# Altium project VG扩展板.PrjPCB
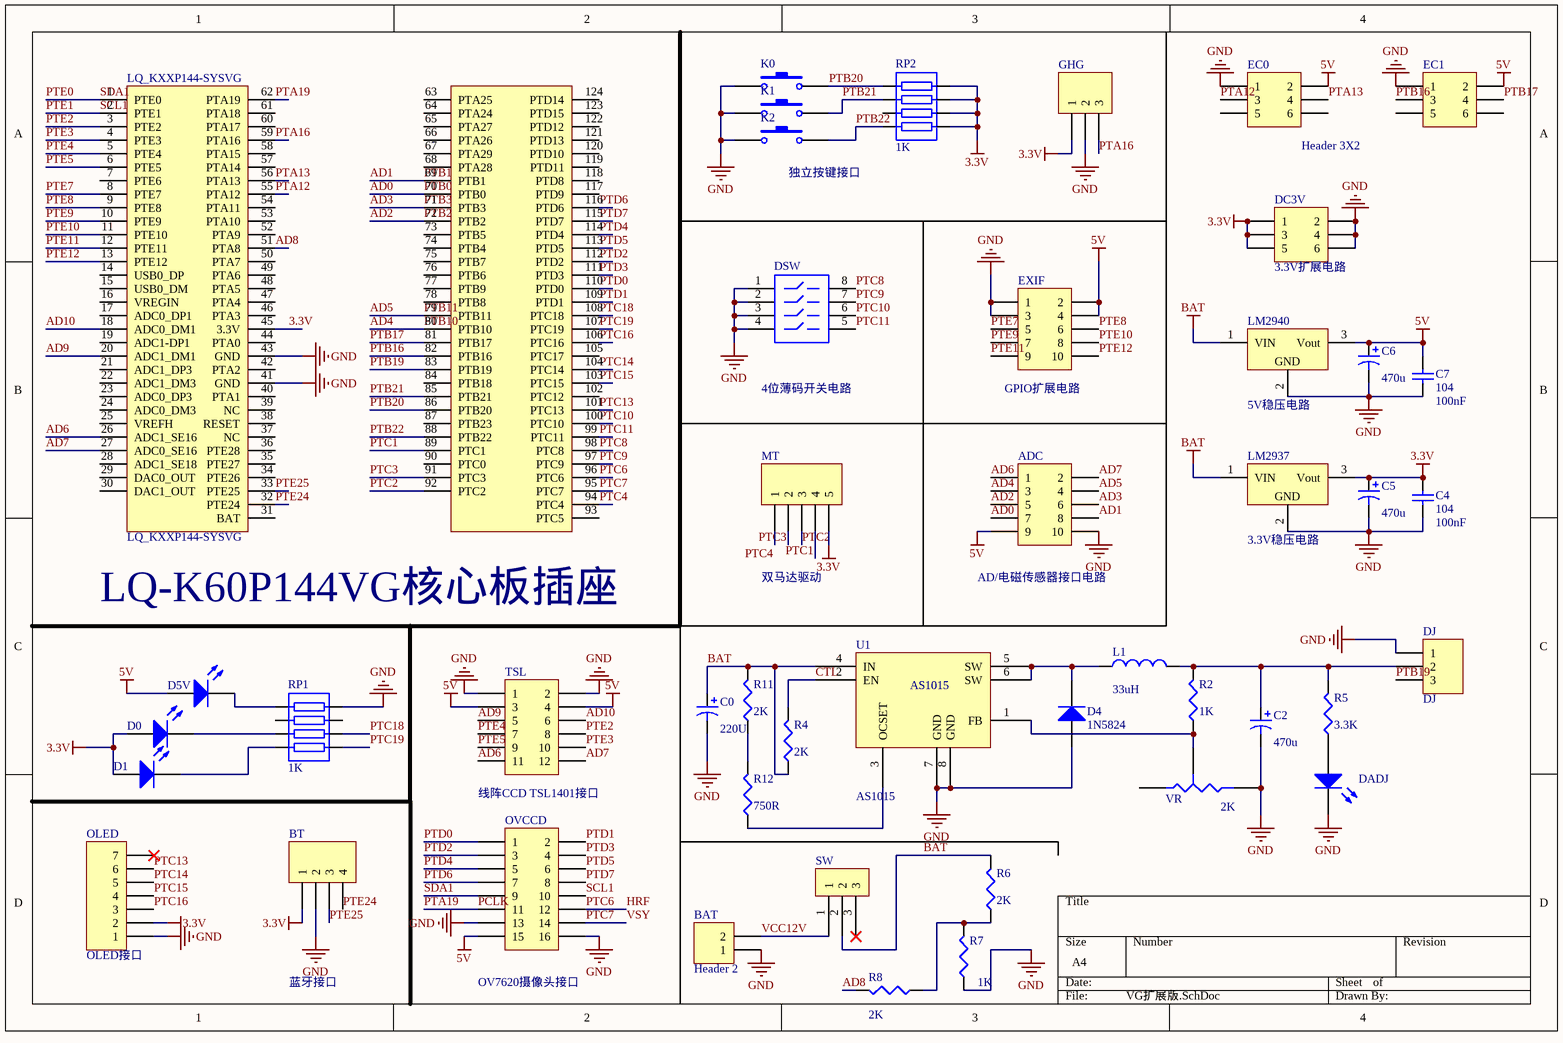
[diagram p0: VG扩展版.SchDoc]
1 sheet, 45 parts. Net scope: global (net labels, ports and power ports of the same name join across sheets).
Board file: VG扩展板.PcbDoc

## Sheet VG扩展版.SchDoc
size A4

### Parts
ADC  AD/电磁传感器接口电路  [HDR2X5]
BAT  Header 2  [power1]
BT  蓝牙接口  [HDR1X4]
C0  value 220U  [rb -5]
C2  value 470u  [3527]
C4  104  value 100nF  [0603]
C5  value 470u  [3527]
C6  value 470u  [3527]
C7  104  value 100nF  [0603]
D0  (no value)  [3.2X1.6X1.1]
D1  (no value)  [3.2X1.6X1.1]
D4  1N5824  [1812_DIODE]
D5V  (no value)  [3.2X1.6X1.1]
DADJ  (no value)  [3.2X1.6X1.1]
DC3V  3.3V扩展电路  [HDR2X3]
DJ  DJ  [HDR1X3]
DSW  4位薄码开关电路  [DIP-8]
EC0  (no value)  [HDR2X3]
EC1  Header 3X2  [HDR2X3]
EXIF  GPIO扩展电路  [HDR2X5]
GHG  (no value)  [HDR1X3]
K0  (no value)  [2512R]
K1  (no value)  [2512R]
K2  (no value)  [2512R]
L1  value 33uH  [CL1010]
LM2937  3.3V稳压电路  [TO263-3]
LM2940  5V稳压电路  [TO263-3]
LQ_KXXP144-SYSVG  LQ_KXXP144-SYSVG  [LQ_KXXP144-SYSVG]
MT  双马达驱动  [HDR1X5]
OLED  OLED接口  [HDR1X7]
OVCCD  OV7620摄像头接口  [HDR2X8]
R2  value 1K  [J1-0603]
R4  value 2K  [J1-0603]
R5  value 3.3K  [J1-0603]
R6  value 2K  [J1-0603]
R7  value 1K  [J1-0603]
R8  value 2K  [J1-0603]
R11  value 2K  [J1-0603]
R12  value 750R  [J1-0603]
RP1  1K  [RESPACK4_SMD]
RP2  1K  [RESPACK4_SMD]
SW  (no value)  [钮子开关 - duplicate]
TSL  线阵CCD TSL1401接口  [HDR2X6]
U1  AS1015  [SOP8L]
VR  value 2K  [3362]

### Nets
3.3V: BT.1 C4.2 C5.1 D0.1(A) D1.1(A) DC3V.1 DC3V.3 DC3V.5 GHG.1 LM2937.3(Vout) LQ_KXXP144-SYSVG.45(3.3V) MT.5 OLED.2 RP2.2 RP2.4 RP2.6 RP2.8
5V: ADC.9 C6.1 C7.2 D5V.1(A) EC0.2 EC1.2 EXIF.2 EXIF.4 LM2940.3(Vout) OVCCD.15 TSL.3 TSL.4
BAT: C0.1 LM2937.1(VIN) LM2940.1(VIN) R4.1 R6.2 R11.2 SW.2 U1.4(IN)
GND: ADC.10 BAT.1 BT.2 C0.2 C2.2 C4.1 C5.2 C6.2 C7.1 D4.1(A) DADJ.2(K) DC3V.2 DC3V.4 DC3V.6 DJ.1 DSW.1 DSW.2 DSW.3 DSW.4 EC0.1 EC1.1 EXIF.1 EXIF.3 GHG.2 K0.1 K1.1 K2.1 LM2937.2(GND) LM2940.2(GND) LQ_KXXP144-SYSVG.41(GND) LQ_KXXP144-SYSVG.43(GND) OLED.1 OVCCD.13 OVCCD.16 R7.1 RP1.2 TSL.1 TSL.2 U1.7(GND) U1.8(GND) VR.2(B)
AD0: ADC.7 LQ_KXXP144-SYSVG.70(PTB0)  [also labelled PTB0]
AD1: ADC.8 LQ_KXXP144-SYSVG.69(PTB1)  [also labelled PTB1]
AD2: ADC.5 LQ_KXXP144-SYSVG.72(PTB2)  [also labelled PTB2]
AD3: ADC.6 LQ_KXXP144-SYSVG.71(PTB3)  [also labelled PTB3]
AD4: ADC.3 LQ_KXXP144-SYSVG.80(PTB10)  [also labelled PTB10]
AD5: ADC.4 LQ_KXXP144-SYSVG.79(PTB11)  [also labelled PTB11]
AD6: ADC.1 LQ_KXXP144-SYSVG.26(ADC1_SE16) TSL.11
AD7: ADC.2 LQ_KXXP144-SYSVG.27(ADC0_SE16) TSL.12
AD8: LQ_KXXP144-SYSVG.51(PTA8) R8.2
AD9: LQ_KXXP144-SYSVG.20(ADC1_DM1) TSL.5
AD10: LQ_KXXP144-SYSVG.18(ADC0_DM1) TSL.6
CTL: R4.2 U1.2(EN)
HRF: LQ_KXXP144-SYSVG.96(PTC6) OVCCD.12  [also labelled PTC6]
PCLK: LQ_KXXP144-SYSVG.62(PTA19) OVCCD.11  [also labelled PTA19]
PTA12: EC0.3 LQ_KXXP144-SYSVG.55(PTA12)
PTA13: EC0.4 LQ_KXXP144-SYSVG.56(PTA13)
PTA16: GHG.3 LQ_KXXP144-SYSVG.59(PTA16)
PTB16: EC1.3 LQ_KXXP144-SYSVG.82(PTB16)
PTB17: EC1.4 LQ_KXXP144-SYSVG.81(PTB17)
PTB19: DJ.3 LQ_KXXP144-SYSVG.83(PTB19)
PTB20: K0.2 LQ_KXXP144-SYSVG.86(PTB20) RP2.1
PTB21: K1.2 LQ_KXXP144-SYSVG.85(PTB21) RP2.3
PTB22: K2.2 LQ_KXXP144-SYSVG.88(PTB22) RP2.7
PTC1: LQ_KXXP144-SYSVG.89(PTC1) MT.4
PTC2: LQ_KXXP144-SYSVG.92(PTC2) MT.3
PTC3: LQ_KXXP144-SYSVG.91(PTC3) MT.2
PTC4: LQ_KXXP144-SYSVG.94(PTC4) MT.1
PTC7: LQ_KXXP144-SYSVG.95(PTC7) OVCCD.14  [also labelled VSY]
PTC8: DSW.8 LQ_KXXP144-SYSVG.98(PTC8)
PTC9: DSW.7 LQ_KXXP144-SYSVG.97(PTC9)
PTC10: DSW.6 LQ_KXXP144-SYSVG.100(PTC10)
PTC11: DSW.5 LQ_KXXP144-SYSVG.99(PTC11)
PTC13: LQ_KXXP144-SYSVG.101(PTC13) OLED.6
PTC14: LQ_KXXP144-SYSVG.104(PTC14) OLED.5
PTC15: LQ_KXXP144-SYSVG.103(PTC15) OLED.4
PTC16: LQ_KXXP144-SYSVG.106(PTC16) OLED.3
PTC18: LQ_KXXP144-SYSVG.108(PTC18) RP1.6
PTC19: LQ_KXXP144-SYSVG.107(PTC19) RP1.8
PTD0: LQ_KXXP144-SYSVG.110(PTD0) OVCCD.1
PTD1: LQ_KXXP144-SYSVG.109(PTD1) OVCCD.2
PTD2: LQ_KXXP144-SYSVG.112(PTD2) OVCCD.3
PTD3: LQ_KXXP144-SYSVG.111(PTD3) OVCCD.4
PTD4: LQ_KXXP144-SYSVG.114(PTD4) OVCCD.5
PTD5: LQ_KXXP144-SYSVG.113(PTD5) OVCCD.6
PTD6: LQ_KXXP144-SYSVG.116(PTD6) OVCCD.7
PTD7: LQ_KXXP144-SYSVG.115(PTD7) OVCCD.8
PTE0: LQ_KXXP144-SYSVG.1(PTE0) OVCCD.9  [also labelled SDA1]
PTE1: LQ_KXXP144-SYSVG.2(PTE1) OVCCD.10  [also labelled SCL1]
PTE2: LQ_KXXP144-SYSVG.3(PTE2) TSL.8
PTE3: LQ_KXXP144-SYSVG.4(PTE3) TSL.10
PTE4: LQ_KXXP144-SYSVG.5(PTE4) TSL.7
PTE5: LQ_KXXP144-SYSVG.6(PTE5) TSL.9
PTE7: EXIF.5 LQ_KXXP144-SYSVG.8(PTE7)
PTE8: EXIF.6 LQ_KXXP144-SYSVG.9(PTE8)
PTE9: EXIF.7 LQ_KXXP144-SYSVG.10(PTE9)
PTE10: EXIF.8 LQ_KXXP144-SYSVG.11(PTE10)
PTE11: EXIF.9 LQ_KXXP144-SYSVG.12(PTE11)
PTE12: EXIF.10 LQ_KXXP144-SYSVG.13(PTE12)
PTE24: BT.4 LQ_KXXP144-SYSVG.32(PTE24)
PTE25: BT.3 LQ_KXXP144-SYSVG.33(PTE25)
VCC12V: BAT.2 SW.1
NetC2_1: C2.1 DJ.2 L1.2 R2.2 R5.2
NetD0_2: D0.2(K) RP1.5
NetD1_2: D1.2(K) RP1.7
NetD4_2: D4.2(K) L1.1 U1.5(SW) U1.6(SW)
NetD5V_2: D5V.2(K) RP1.1
NetDADJ_1: DADJ.1(A) R5.1
NetR2_1: R2.1 U1.1(FB) VR.3(TAP)
NetR6_1: R6.1 R7.2 R8.1
NetR11_1: R11.1 R12.2
NetR12_1: R12.1 U1.3(OCSET)

Not connected (* = marked no-connect by the designer): EC0 5 6; EC1 5 6; LQ_KXXP144-SYSVG 7(PTE6) 14(USB0_DP) 15(USB0_DM) 16(VREGIN) 17(ADC0_DP1) 19(ADC1-DP1) 21(ADC1_DP3) 22(ADC1_DM3) 23(ADC0_DP3) 24(ADC0_DM3) 25(VREFH) 28(ADC1_SE18) 29(DAC0_OUT) 30(DAC1_OUT) 31(BAT) 34(PTE26) 35(PTE27) 36(PTE28) 37(NC) 38(RESET) 39(NC) 40(PTA1) 42(PTA2) 44(PTA0) 46(PTA3) 47(PTA4) 48(PTA5) 49(PTA6) 50(PTA7) 52(PTA9) 53(PTA10) 54(PTA11) 57(PTA14) 58(PTA15) 60(PTA17) 61(PTA18) 63(PTA25) 64(PTA24) 65(PTA27) 66(PTA26) 67(PTA29) 68(PTA28) 73(PTB5) 74(PTB4) 75(PTB7) 76(PTB6) 77(PTB9) 78(PTB8) 84(PTB18) 87(PTB23) 90(PTC0) 93(PTC5) 102(PTC12) 105(PTC17) 117(PTD9) 118(PTD8) 119(PTD11) 120(PTD10) 121(PTD13) 122(PTD12) 123(PTD15) 124(PTD14); OLED 7*; RP1 3 4; RP2 5; SW 3*; VR 1(A)

### Notes on the sheet
- (near K2) 独立按键接口
- (near LQ_KXXP144-SYSVG) LQ-K60P144VG核心板插座

### Library data of the parts
ADC EXIF = Header 5X2: Header, 5-Pin, Dual row; LatestRevisionDate: 17-Jul-2002; LatestRevisionNote: Re-released for DXP Platform.; Publisher: Altium Limited
BAT = Header 2: Header, 2-Pin; LatestRevisionDate: 17-Jul-2002; LatestRevisionNote: Re-released for DXP Platform.; Publisher: Altium Limited
BT = Header 4: Header, 4-Pin; LatestRevisionDate: 17-Jul-2002; LatestRevisionNote: Re-released for DXP Platform.; Publisher: Altium Limited
C0 = Cap Pol1: Polarized Capacitor (Radial); Published: 8-Jun-2000; LatestRevisionDate: 17-Jul-2002; LatestRevisionNote: Re-released for DXP Platform.; PackageReference: RB7.6-15; Publisher: Altium Limited; PackageDescription: Polarized Capacitor (Radial); 2 Leads
C2 C5 C6 = Cap Pol3: Polarized Capacitor (Surface Mount); Published: 8-Jun-2000; LatestRevisionDate: 29-May-2009; LatestRevisionNote: IPC-7351 Footprint Added.; PackageReference: C0805; Publisher: Altium Limited; PackageDescription: Chip Capacitor
C4 C7 = Cap Semi: Capacitor (Semiconductor SIM Model); Published: 8-Jun-2000; LatestRevisionDate: 29-May-2009; LatestRevisionNote: IPC-7351 Footprint Added.; PackageReference: C1206; Publisher: Altium Limited; PackageDescription: Chip Capacitor
D0 D1 D5V DADJ = LED3: Typical BLUE SiC LED; Published: 8-Jun-2000; LatestRevisionDate: 17-Dec-2003; LatestRevisionNote: PCB Footprint replaced.; DatasheetVersion: 16-Apr-2002; PackageVersion: 16-Apr-2002; PackageReference: 3.5X2.8X1.9; Publisher: Altium Limited; PackageDescription: SM LED; 2 C-Bend Leads; Body 3.5 x 2.8 x 1.9 mm, inc leads (LxWxH typ)
D4 = Diode: Default Diode; Published: 8-Jun-2000; LatestRevisionDate: 17-Jul-2002; LatestRevisionNote: Re-released for DXP Platform.; PackageVersion: Sep-1996; PackageReference: SMC; Publisher: Altium Limited; PackageDescription: DO-214-AB/SMC; 2 C-Bend Leads; Body 7.9 x 5.9 mm, inc. leads (LxW); Code_JEDEC: DO-214-AB
DC3V = Header 3X2H: Header, 3-Pin, Dual row, Right Angle; LatestRevisionDate: 17-Jul-2002; LatestRevisionNote: Re-released for DXP Platform.; Publisher: Altium Limited
DJ GHG = Header 3: Header, 3-Pin; LatestRevisionDate: 17-Jul-2002; LatestRevisionNote: Re-released for DXP Platform.; Publisher: Altium Limited
DSW = SW-DIP4: DIP Switch; Published: 24-Mar-1999; LatestRevisionDate: 17-Jul-2002; LatestRevisionNote: Re-released for DXP Platform.; PackageReference: DIP-8; Publisher: Altium Limited
EC0 EC1 = Header 3X2: Header, 3-Pin, Dual row; LatestRevisionDate: 17-Jul-2002; LatestRevisionNote: Re-released for DXP Platform.; Publisher: Altium Limited
K0-K2 = SW-PB: Switch; Published: 24-Mar-1999; LatestRevisionDate: 17-Jul-2002; LatestRevisionNote: Re-released for DXP Platform.; PackageReference: SPST-2; Publisher: Altium Limited; PackageDescription: Switch; 2 Leads
L1 = Inductor: Code_IEC: 1005; Published: 8-Jun-2000; LatestRevisionDate: 29-May-2009; LatestRevisionNote: IPC-7351 Footprint Added.; PackageReference: 0402-A; Publisher: Altium Limited; PackageDescription: Chip Inductor; Code_JEITA: 0402
LM2937 LM2940 = LM2940: 固定5V输出直流稳压芯片
MT = Header 5: Header, 5-Pin; LatestRevisionDate: 17-Jul-2002; LatestRevisionNote: Re-released for DXP Platform.; Publisher: Altium Limited
OLED = Header 7: Header, 7-Pin; LatestRevisionDate: 17-Jul-2002; LatestRevisionNote: Re-released for DXP Platform.; Publisher: Altium Limited
OVCCD = Header 8X2: Header, 8-Pin, Dual row; LatestRevisionDate: 17-Jul-2002; LatestRevisionNote: Re-released for DXP Platform.; Publisher: Altium Limited
R2 R4-R8 R11 R12 = Res3: Resistor; Published: 8-Jun-2000; LatestRevisionDate: 29-May-2009; LatestRevisionNote: IPC-7351 Footprint Added.; PackageReference: J1-0603; Publisher: Altium Limited; PackageDescription: Chip Resistor
RP1 RP2 = RESPACK4
SW = 钮子开关
TSL = Header 6X2: Header, 6-Pin, Dual row; LatestRevisionDate: 17-Jul-2002; LatestRevisionNote: Re-released for DXP Platform.; Publisher: Altium Limited
VR = Res Tap: Tapped Resistor; Sim Note: Enter the Resistance value and the set point into parameter fields.; Set Position: 0.5; Published: 24-Mar-1999; LatestRevisionDate: 17-Jul-2002; LatestRevisionNote: Re-released for DXP Platform.; PackageReference: VR3; Publisher: Altium Limited; PackageDescription: Variable Resistor, Thru-Hole; 3 Leads